# EasyEDA schematic SCH_linefollower_2024-05-15.json
TITLE: MIssion Mars; REV: 1.0; Date: 2024-03-17; Sheet: 1/1; Drawn By: hamidhere47; Company: Your Company
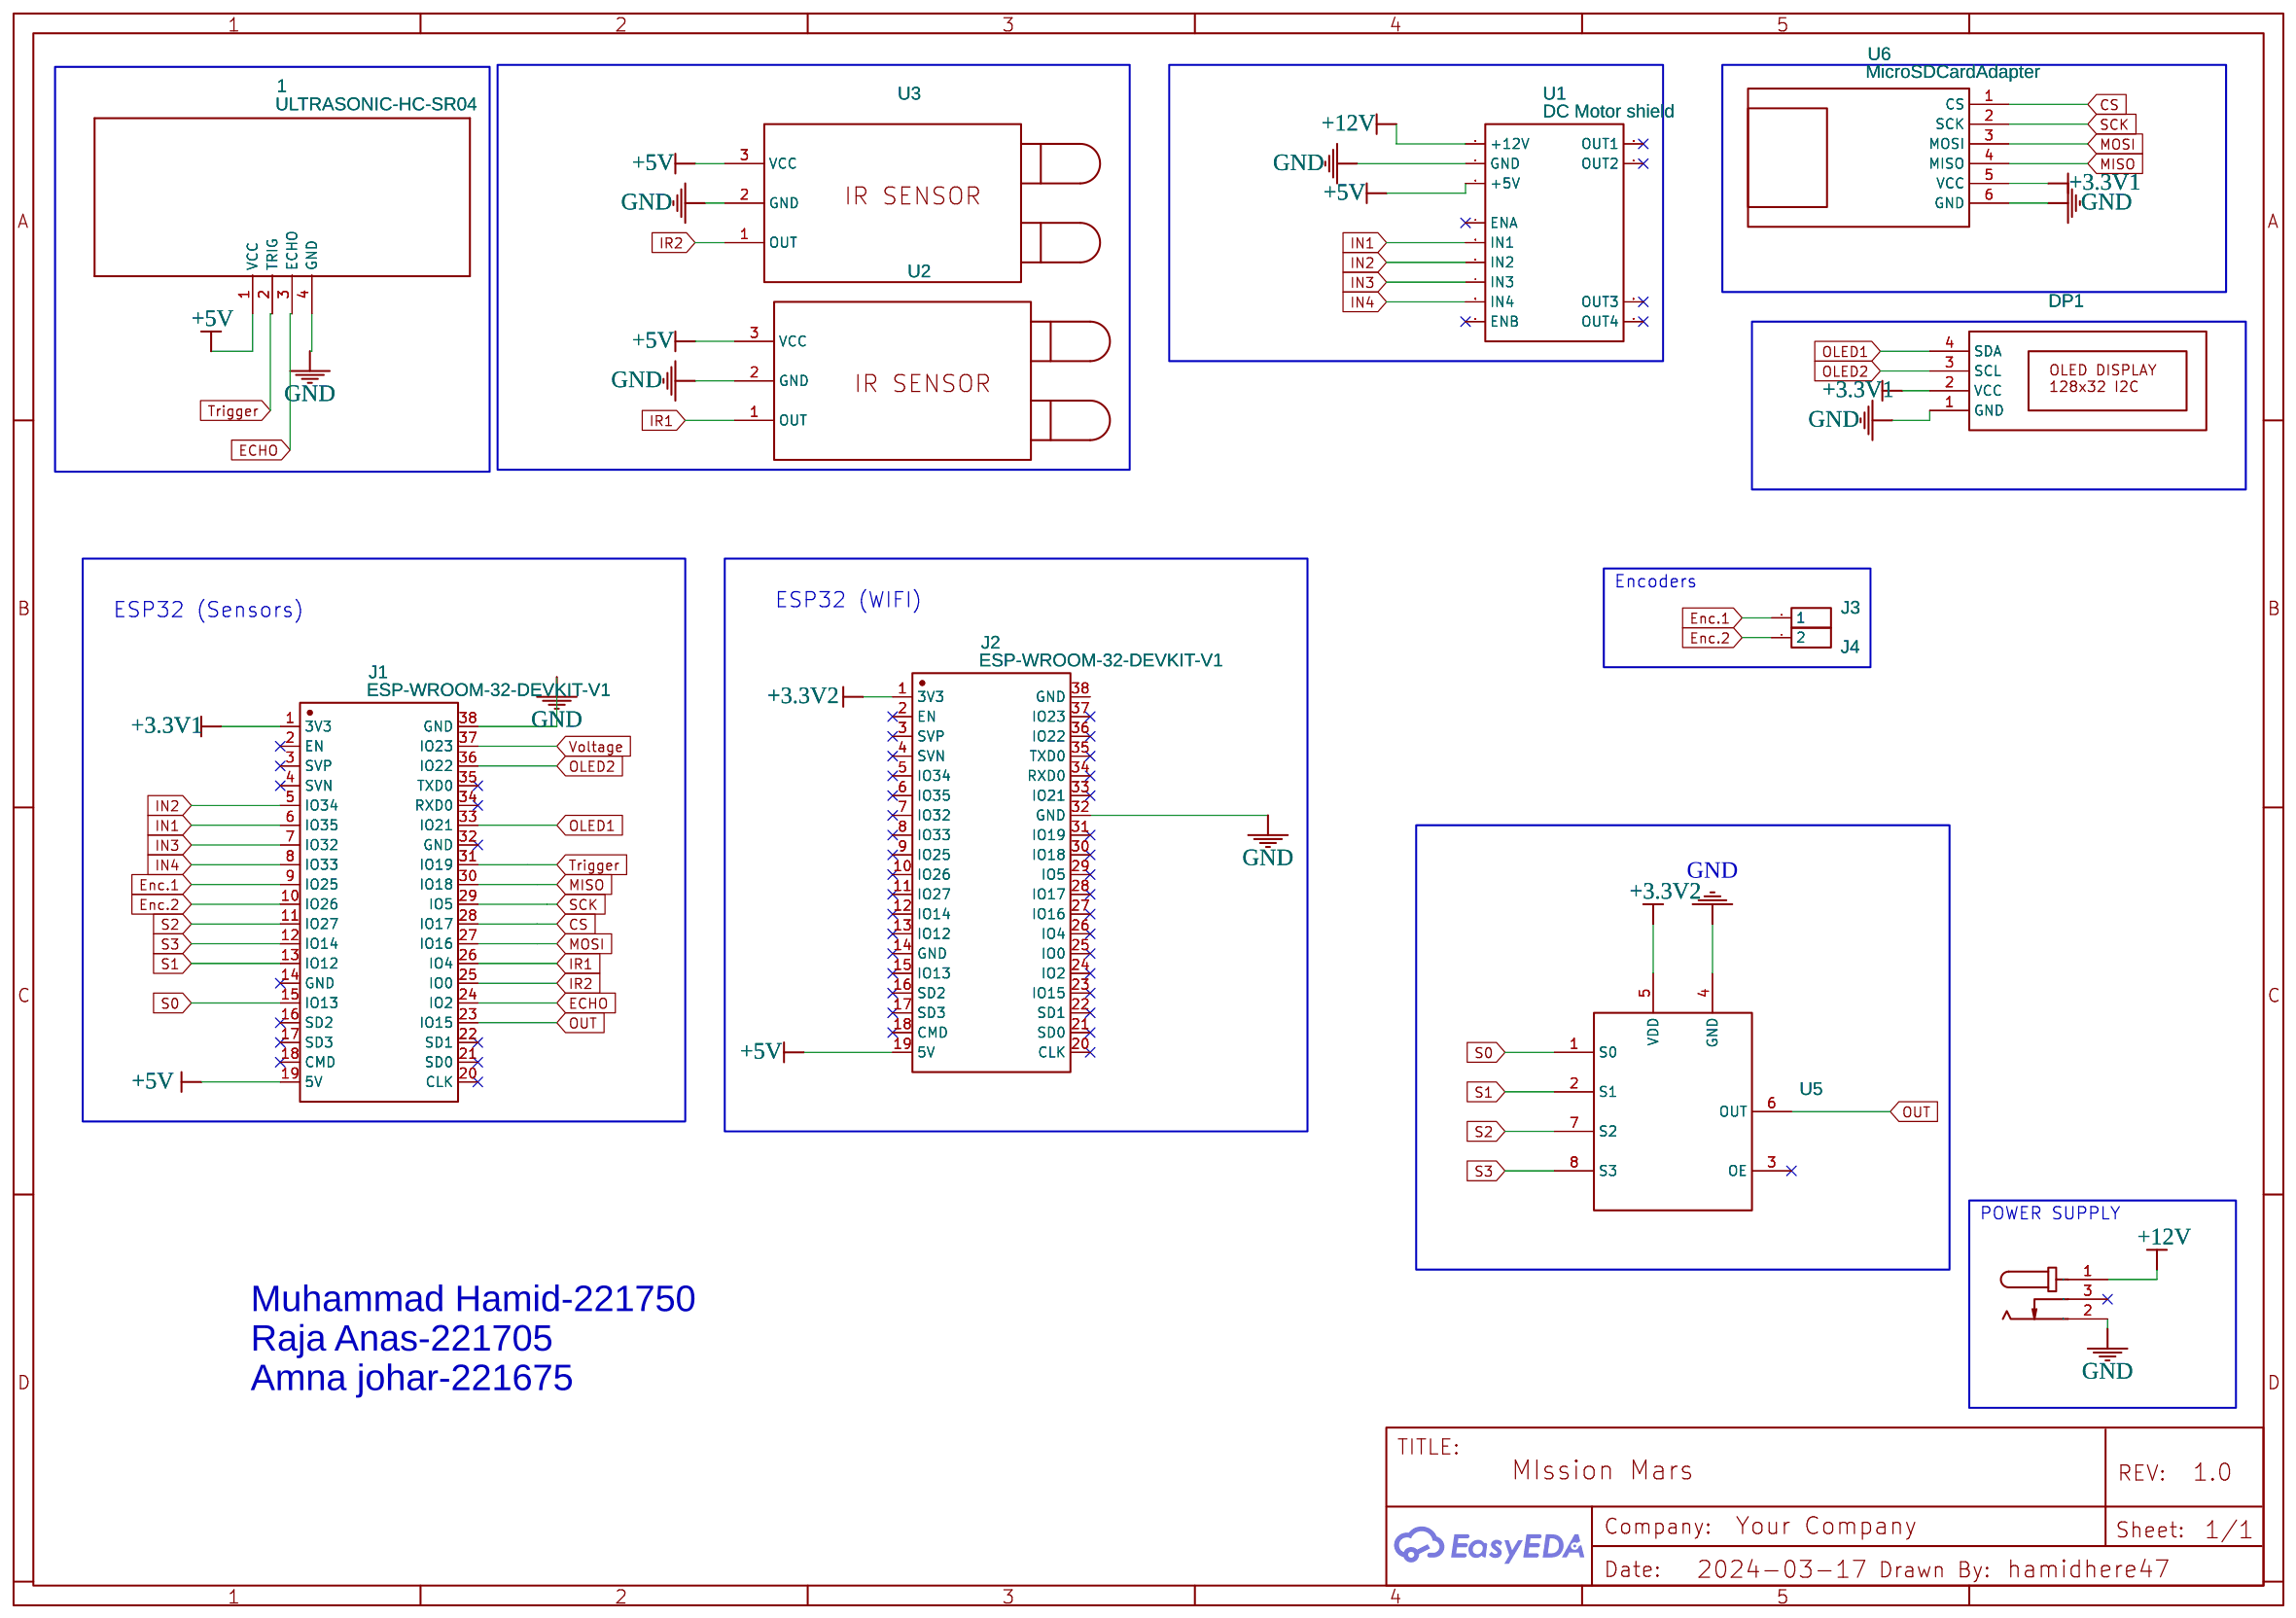
[diagram p0: schematic sheet]

## Parts
1  ULTRASONIC-HC-SR04  [ULTRASONIC-HC-SR04]
DC1  DC005-2.0MM  [DC-IN-TH_DC005]
DP1  OLED DISPLAY 128x32 0.91" I2C SSD1306  [OLED-TH-C128-R64-D0.91-I2C-SSD1306]
J1  ESP-WROOM-32-DEVKIT-V1  [ESP32_DEVKITC]
J2  ESP-WROOM-32-DEVKIT-V1  [ESP32_DEVKITC]
J3  HDR-M-2.54_1x1  [HDR-M-2.54_1X1]
J4  HDR-M-2.54_1x1  [HDR-M-2.54_1X1]
U1  DC Motor shield  [L298N]
U2  IR PROXIMITY SENSOR MODULE PSH  [IR PROXIMITY SENSOR MODULE]
U3  IR PROXIMITY SENSOR MODULE PSH  [IR PROXIMITY SENSOR MODULE]
U5  TCS3200 _ Symbol Schematic  [TCS3200]
U6  MicroSDCardAdapter  [MICROSDCARDADAPTER]

## Library data of the parts
1 = ULTRASONIC-HC-SR04: Contributor: pawelze
DC1 = DC005-2.0MM: Supplier: LCSC; Manufacturer: SOFNG; Supplier Part: C111567
DP1 = OLED DISPLAY 128x32 0.91" I2C SSD1306: Contributor: khav
J1 J2 = ESP-WROOM-32-DEVKIT-V1
J3 J4 = HDR-M-2.54_1x1: Supplier Part: C81276; Supplier: LCSC; Contributor: LCEDA_Lib
U1 = DC Motor shield: Contributor: jeff.morris255
U2 U3 = IR PROXIMITY SENSOR MODULE PSH: Contributor: Muhammad Taufiq
U5 = TCS3200 _ Symbol Schematic: Contributor: hy.pham01253; subpart_no: 1
U6 = MicroSDCardAdapter: Contributor: dfasdgadg; Package Display: No

## Nets
+3.3V1: DP1.2(VCC) J1.1(3V3) U6.5(VCC)
+3.3V2: J2.1(3V3) U5.5(VDD)
+5V: 1.1(VCC) J1.19(5V) J2.19(5V) U1.3(+5V) U2.3(VCC) U3.3(VCC)
+12V: DC1.1 U1.1(+12V)
GND: 1.4(GND) DC1.2 DP1.1(GND) J1.38(GND) J2.32(GND) U1.2(GND) U2.2(GND) U3.2(GND) U5.4(GND) U6.6(GND)
CS: J1.28(IO17) U6.1(CS)
ECHO: 1.3(ECHO) J1.24(IO2)
Enc.1: J1.9(IO25) J3.1
Enc.2: J1.10(IO26) J4.1(2)
IN1: J1.6(IO35) U1.5(IN1)
IN2: J1.5(IO34) U1.6(IN2)
IN3: J1.7(IO32) U1.7(IN3)
IN4: J1.8(IO33) U1.8(IN4)
IR1: J1.26(IO4) U2.1(OUT)
IR2: J1.25(IO0) U3.1(OUT)
MISO: J1.30(IO18) U6.4(MISO)
MOSI: J1.27(IO16) U6.3(MOSI)
OLED1: DP1.4(SDA) J1.33(IO21)
OLED2: DP1.3(SCL) J1.36(IO22)
OUT: J1.23(IO15) U5.6(OUT)
S0: J1.15(IO13) U5.1(S0)
S1: J1.13(IO12) U5.2(S1)
S2: J1.11(IO27) U5.7(S2)
S3: J1.12(IO14) U5.8(S3)
SCK: J1.29(IO5) U6.2(SCK)
Trigger: 1.2(TRIG) J1.31(IO19)
Voltage: J1.37(IO23)

Not connected (* = marked no-connect by the designer): DC1 3*; J1 2(EN)* 3(SVP)* 4(SVN)* 14(GND)* 16(SD2)* 17(SD3)* 18(CMD)* 20(CLK)* 21(SD0)* 22(SD1)* 32(GND)* 34(RXD0)* 35(TXD0)*; J2 2(EN)* 3(SVP)* 4(SVN)* 5(IO34)* 6(IO35)* 7(IO32)* 8(IO33)* 9(IO25)* 10(IO26)* 11(IO27)* 12(IO14)* 13(IO12)* 14(GND)* 15(IO13)* 16(SD2)* 17(SD3)* 18(CMD)* 20(CLK)* 21(SD0)* 22(SD1)* 23(IO15)* 24(IO2)* 25(IO0)* 26(IO4)* 27(IO16)* 28(IO17)* 29(IO5)* 30(IO18)* 31(IO19)* 33(IO21)* 34(RXD0)* 35(TXD0)* 36(IO22)* 37(IO23)* 38(GND); U1 4(ENA)* 9(ENB)* 10(OUT1)* 11(OUT2)* 12(OUT4)* 13(OUT3)*; U5 3(OE)*

## Notes on the sheet
- Encoders
- ESP32 (Sensors)
- ESP32 (WIFI)
- POWER SUPPLY
- Muhammad Hamid-221750
- Raja Anas-221705
- Amna johar-221675
